# Altium schematic sheet TEST_TOP.SchDoc
size B; Organization: Altium Limited; Address1: L3, 12a Rodborough Rd; Address2: Frenchs Forest; Address3: NSW; Address4: Australia 2086; SheetNumber: 1
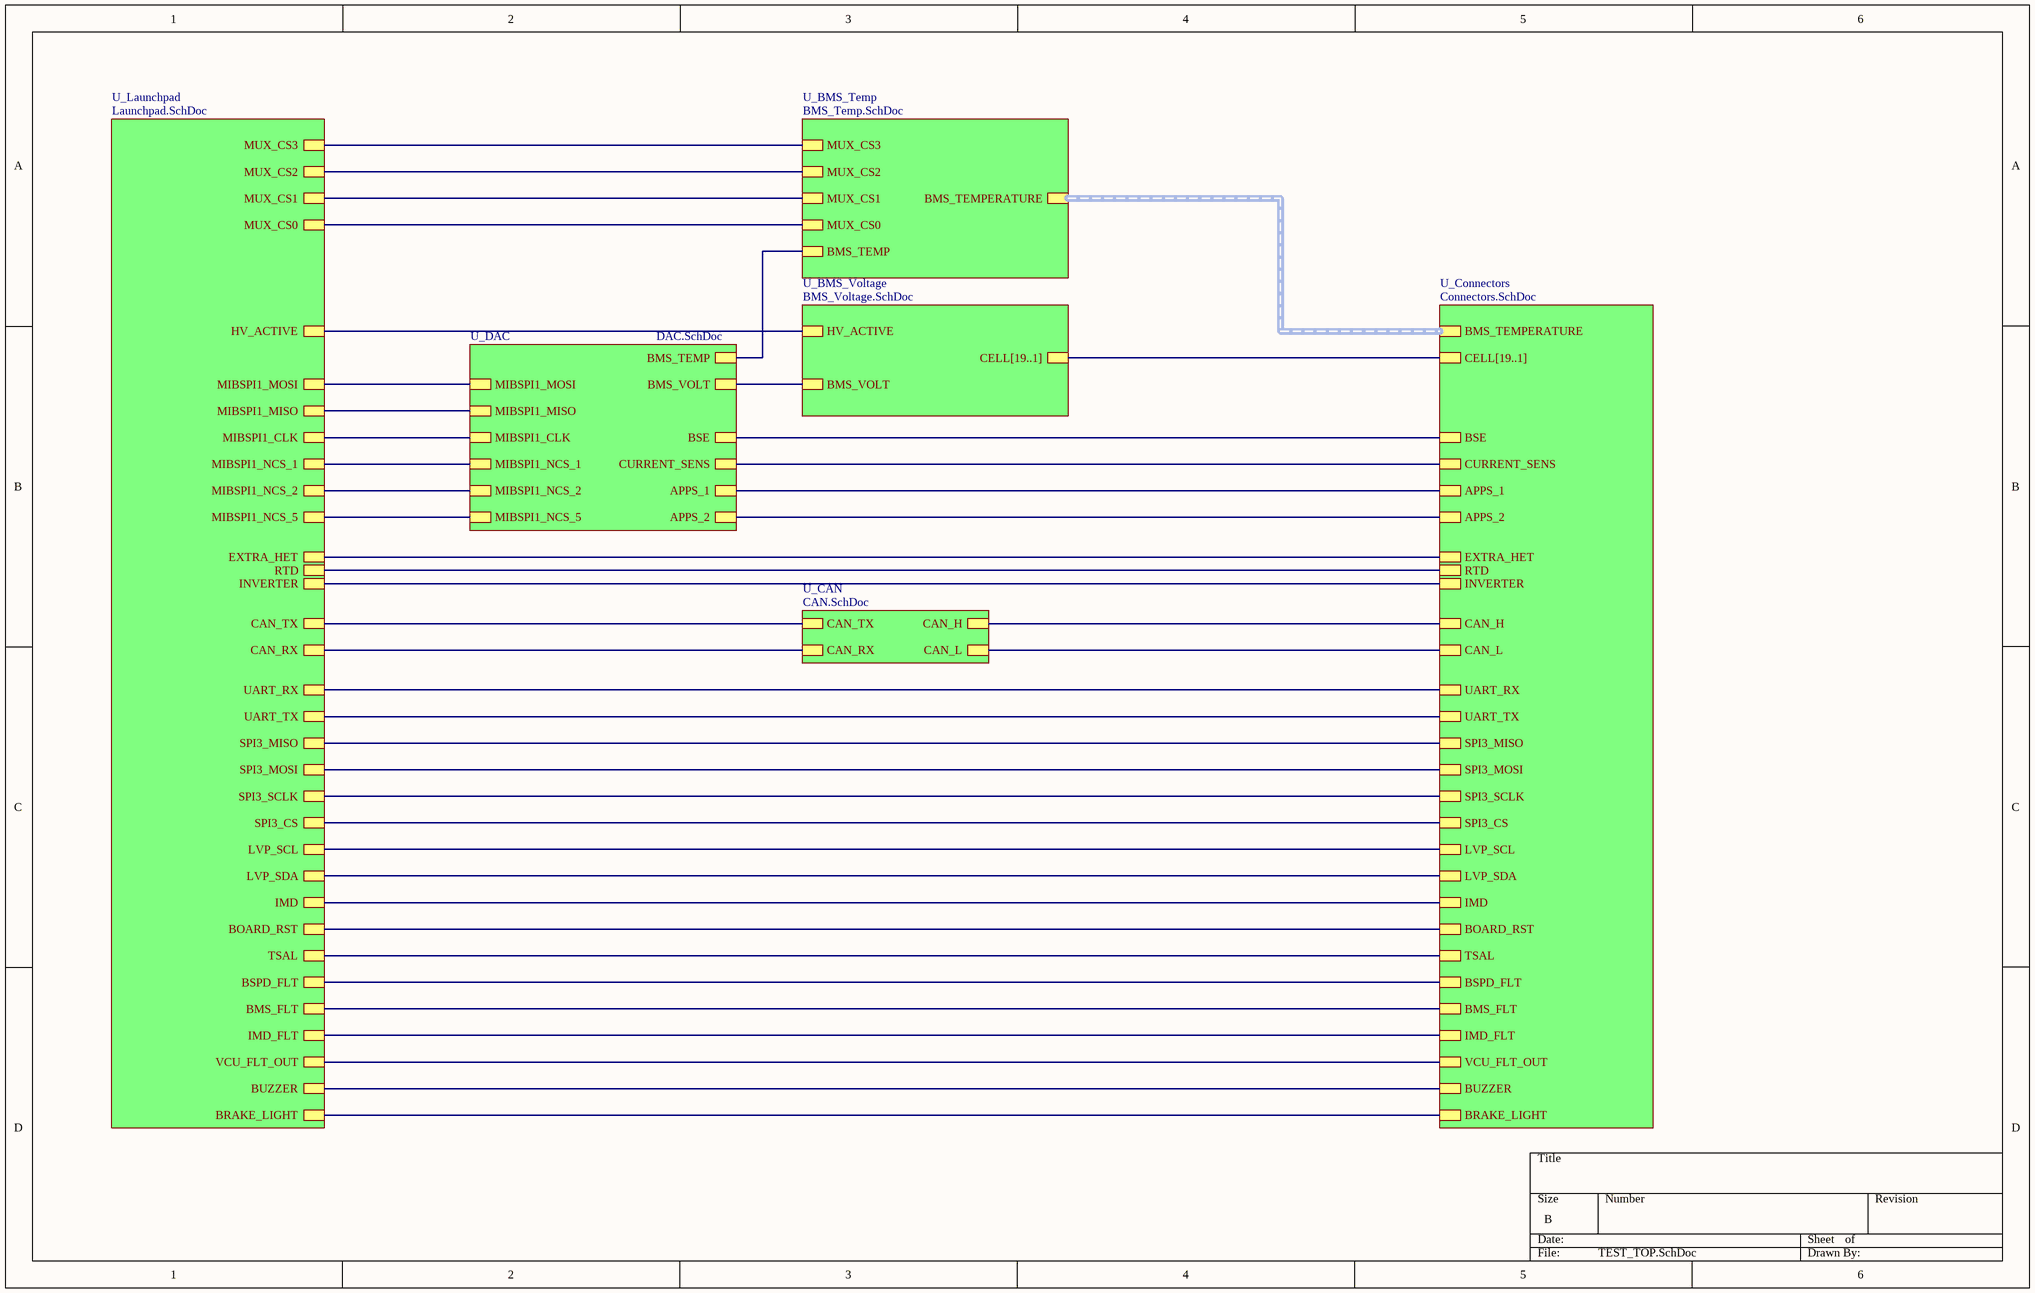
[diagram p0: TEST_TOP.SchDoc]

## Sub-sheets
U_BMS_Temp = BMS_Temp.SchDoc: MUX_CS3, MUX_CS2, MUX_CS1, MUX_CS0, BMS_TEMP, BMS_TEMPERATURE (harness TEMP)
U_BMS_Voltage = BMS_Voltage.SchDoc: HV_ACTIVE, BMS_VOLT, CELL[19..1]
U_CAN = CAN.SchDoc: CAN_TX, CAN_RX, CAN_H, CAN_L
U_Connectors = Connectors.SchDoc: CAN_H, CAN_L, CURRENT_SENS, BSE, APPS_1, APPS_2, SPI3_CS, SPI3_SCLK, SPI3_MOSI, SPI3_MISO, LVP_SCL, LVP_SDA, BOARD_RST, IMD, TSAL, BSPD_FLT, BMS_FLT, IMD_FLT, VCU_FLT_OUT, BUZZER, BRAKE_LIGHT, BMS_TEMPERATURE (harness TEMP), UART_RX, UART_TX, CELL[19..1], EXTRA_HET, INVERTER, RTD
U_DAC = DAC.SchDoc: CURRENT_SENS, BSE, BMS_TEMP, BMS_VOLT, APPS_1, APPS_2, MIBSPI1_MOSI, MIBSPI1_MISO, MIBSPI1_CLK, MIBSPI1_NCS_1, MIBSPI1_NCS_2, MIBSPI1_NCS_5
U_Launchpad = Launchpad.SchDoc: MUX_CS2, MUX_CS3, MUX_CS1, MUX_CS0, SPI3_CS, SPI3_SCLK, SPI3_MOSI, SPI3_MISO, HV_ACTIVE, BOARD_RST, IMD, TSAL, CAN_TX, CAN_RX, LVP_SCL, LVP_SDA, MIBSPI1_MOSI, MIBSPI1_MISO, MIBSPI1_CLK, MIBSPI1_NCS_1, MIBSPI1_NCS_2, MIBSPI1_NCS_5, UART_RX, UART_TX, BSPD_FLT, BMS_FLT, IMD_FLT, VCU_FLT_OUT, BUZZER, BRAKE_LIGHT, EXTRA_HET, INVERTER, RTD

## Nets
(unnamed): sheet U_CAN/CAN_TX, sheet U_Launchpad/CAN_TX
(unnamed): sheet U_CAN/CAN_RX, sheet U_Launchpad/CAN_RX
(unnamed): sheet U_CAN/CAN_H, sheet U_Connectors/CAN_H
(unnamed): sheet U_CAN/CAN_L, sheet U_Connectors/CAN_L
(unnamed): sheet U_Launchpad/MUX_CS2, sheet U_BMS_Temp/MUX_CS2
(unnamed): sheet U_Launchpad/MUX_CS3, sheet U_BMS_Temp/MUX_CS3
(unnamed): sheet U_Launchpad/MUX_CS1, sheet U_BMS_Temp/MUX_CS1
(unnamed): sheet U_Launchpad/MUX_CS0, sheet U_BMS_Temp/MUX_CS0
(unnamed): sheet U_Launchpad/SPI3_CS, sheet U_Connectors/SPI3_CS
(unnamed): sheet U_Launchpad/SPI3_SCLK, sheet U_Connectors/SPI3_SCLK
(unnamed): sheet U_Launchpad/SPI3_MOSI, sheet U_Connectors/SPI3_MOSI
(unnamed): sheet U_Launchpad/SPI3_MISO, sheet U_Connectors/SPI3_MISO
(unnamed): sheet U_Launchpad/HV_ACTIVE, sheet U_BMS_Voltage/HV_ACTIVE
(unnamed): sheet U_Launchpad/BOARD_RST, sheet U_Connectors/BOARD_RST
(unnamed): sheet U_Launchpad/IMD, sheet U_Connectors/IMD
(unnamed): sheet U_Launchpad/TSAL, sheet U_Connectors/TSAL
(unnamed): sheet U_Launchpad/LVP_SCL, sheet U_Connectors/LVP_SCL
(unnamed): sheet U_Launchpad/LVP_SDA, sheet U_Connectors/LVP_SDA
(unnamed): sheet U_Launchpad/MIBSPI1_MOSI, sheet U_DAC/MIBSPI1_MOSI
(unnamed): sheet U_Launchpad/MIBSPI1_MISO, sheet U_DAC/MIBSPI1_MISO
(unnamed): sheet U_Launchpad/MIBSPI1_CLK, sheet U_DAC/MIBSPI1_CLK
(unnamed): sheet U_Launchpad/MIBSPI1_NCS_1, sheet U_DAC/MIBSPI1_NCS_1
(unnamed): sheet U_Launchpad/MIBSPI1_NCS_2, sheet U_DAC/MIBSPI1_NCS_2
(unnamed): sheet U_Launchpad/MIBSPI1_NCS_5, sheet U_DAC/MIBSPI1_NCS_5
(unnamed): sheet U_Launchpad/UART_RX, sheet U_Connectors/UART_RX
(unnamed): sheet U_Launchpad/UART_TX, sheet U_Connectors/UART_TX
(unnamed): sheet U_Launchpad/BSPD_FLT, sheet U_Connectors/BSPD_FLT
(unnamed): sheet U_Launchpad/BMS_FLT, sheet U_Connectors/BMS_FLT
(unnamed): sheet U_Launchpad/IMD_FLT, sheet U_Connectors/IMD_FLT
(unnamed): sheet U_Launchpad/VCU_FLT_OUT, sheet U_Connectors/VCU_FLT_OUT
(unnamed): sheet U_Launchpad/BUZZER, sheet U_Connectors/BUZZER
(unnamed): sheet U_Launchpad/BRAKE_LIGHT, sheet U_Connectors/BRAKE_LIGHT
(unnamed): sheet U_Launchpad/EXTRA_HET, sheet U_Connectors/EXTRA_HET
(unnamed): sheet U_Launchpad/INVERTER, sheet U_Connectors/INVERTER
(unnamed): sheet U_Launchpad/RTD, sheet U_Connectors/RTD
(unnamed): sheet U_DAC/CURRENT_SENS, sheet U_Connectors/CURRENT_SENS
(unnamed): sheet U_DAC/BSE, sheet U_Connectors/BSE
(unnamed): sheet U_DAC/BMS_TEMP, sheet U_BMS_Temp/BMS_TEMP
(unnamed): sheet U_DAC/BMS_VOLT, sheet U_BMS_Voltage/BMS_VOLT
(unnamed): sheet U_DAC/APPS_1, sheet U_Connectors/APPS_1
(unnamed): sheet U_DAC/APPS_2, sheet U_Connectors/APPS_2

## Buses and harness runs
bus sheet U_BMS_Voltage/CELL[19..1] = sheet U_Connectors/CELL[19..1]
harness sheet U_BMS_Temp/BMS_TEMPERATURE = sheet U_Connectors/BMS_TEMPERATURE

## Notes on the sheet
- Title
- Size:
- Date:
- B
- Number:
- Time:
- Revision:
- Sheet
- of
- File: